# EAGLE design esp32_ics (EAGLE 9.6.2)
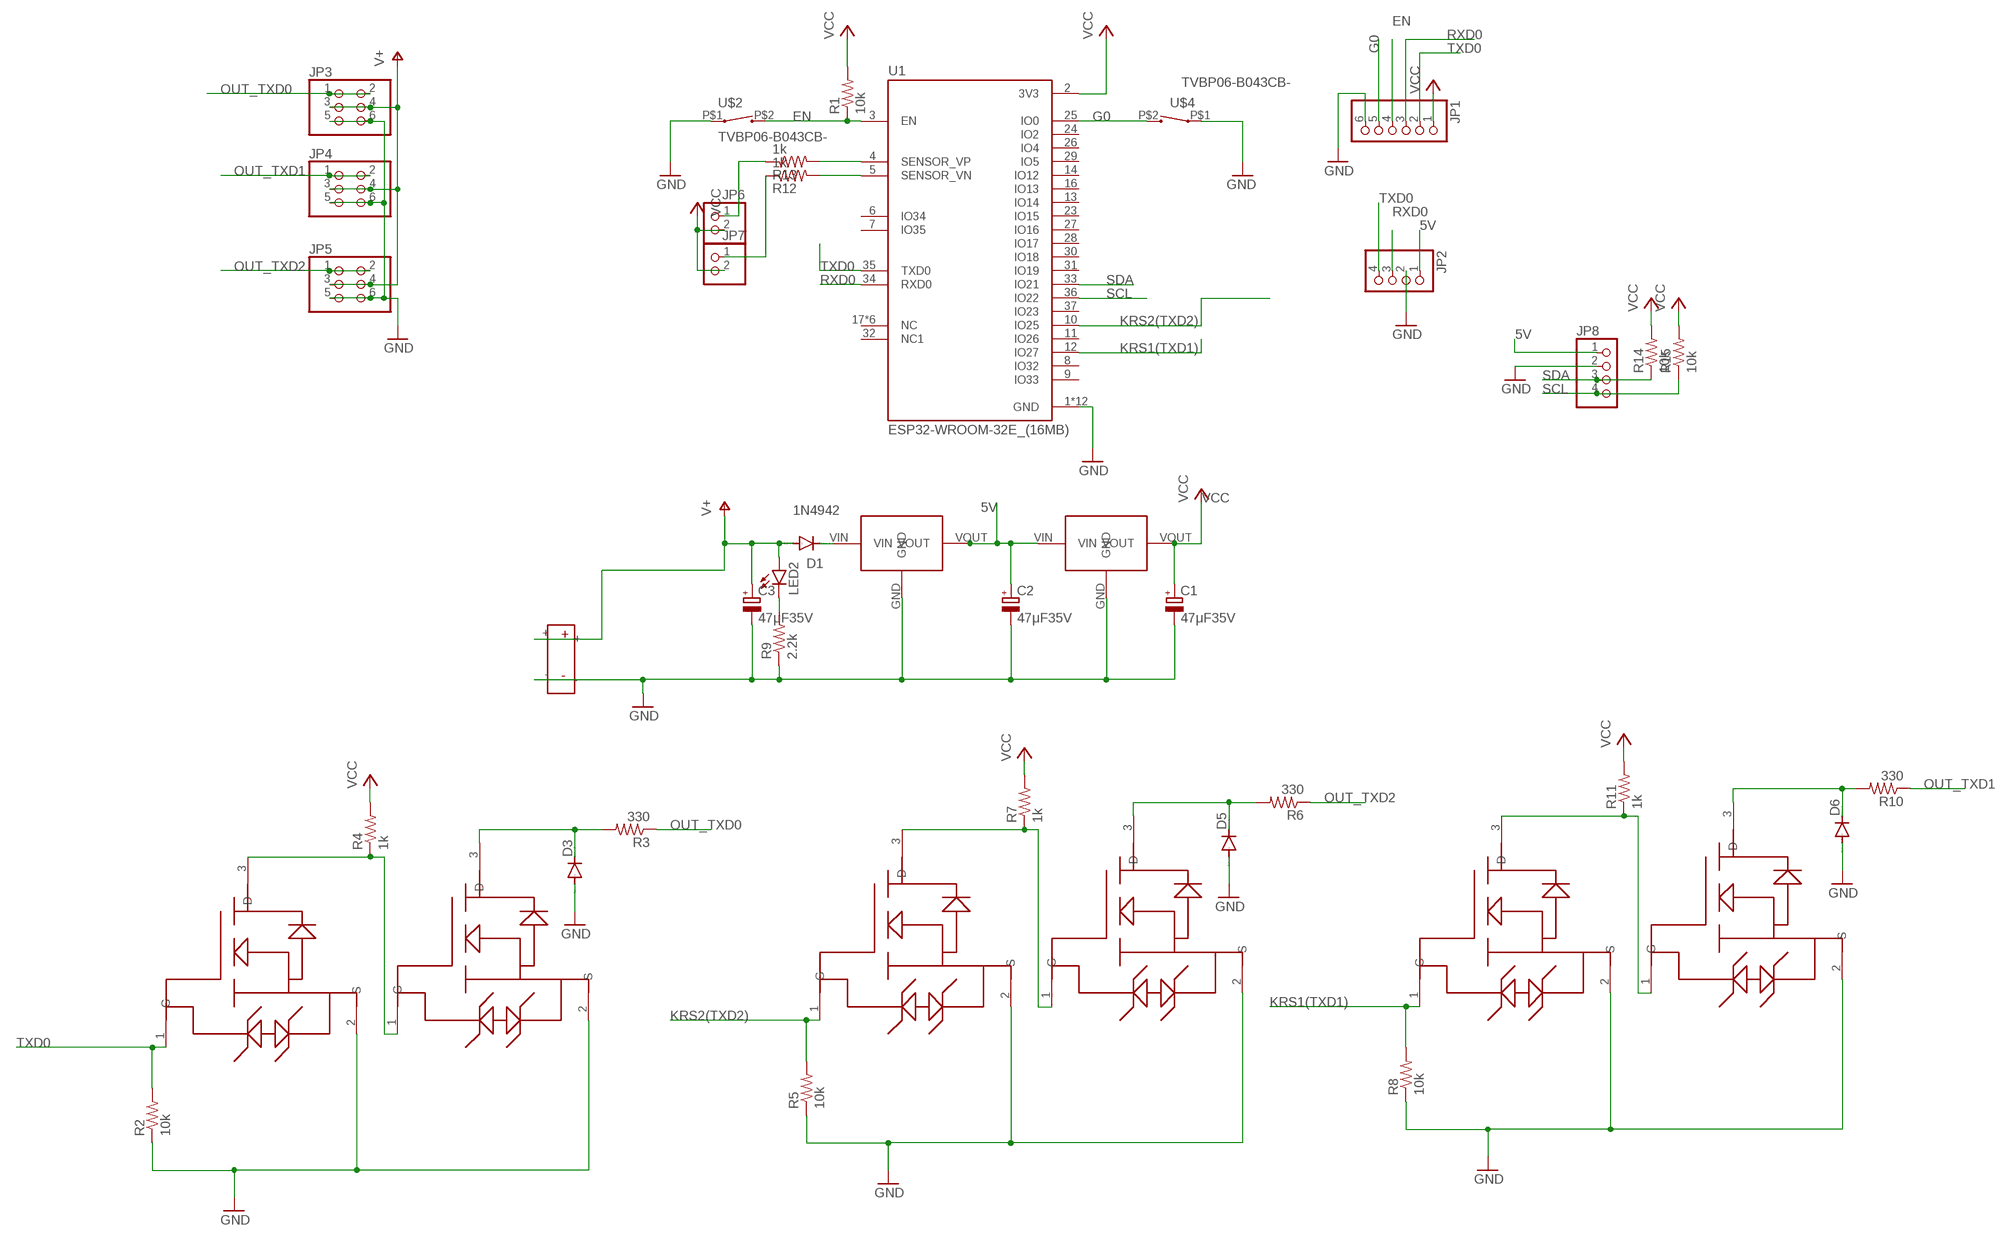
[diagram p0: schematic, sheet 1]

## Parts
C1  47μF35V  CPOL-EUE2-4  [E2-4]
C2  47μF35V  CPOL-EUE2-4  [E2-4]
C3  47μF35V  CPOL-EUE2-4  [E2-4]
D1  1N4942  [DO41-10]
D3  DIODE-SOD323-R  [SOD323-R]
D5  DIODE-SOD323-R  [SOD323-R]
D6  DIODE-SOD323-R  [SOD323-R]
JP1  PINHD-1X6  [1X06]
JP2  PINHD-1X4  [1X04]
JP3  PINHD-2X3/90  [2X03/90]
JP4  PINHD-2X3/90  [2X03/90]
JP5  PINHD-2X3/90  [2X03/90]
JP6  PINHD-1X2  [1X02]
JP7  PINHD-1X2  [1X02]
JP8  PINHD-1X4  [1X04]
LED2  LEDCHIP-LED0603  [CHIP-LED0603]
R1  10k  R-US_R0603  [R0603]
R2  10k  R-US_R0603  [R0603]
R3  330  R-US_R0603  [R0603]
R4  1k  R-US_R0603  [R0603]
R5  10k  R-US_R0603  [R0603]
R6  330  R-US_R0603  [R0603]
R7  1k  R-US_R0603  [R0603]
R8  10k  R-US_R0603  [R0603]
R9  2.2k  R-US_R0603  [R0603]
R10  330  R-US_R0603  [R0603]
R11  1k  R-US_R0603  [R0603]
R12  1k  R-US_R0603  [R0603]
R13  1k  R-US_R0603  [R0603]
R14  10k  R-US_R0603  [R0603]
R15  10k  R-US_R0603  [R0603]
U1  ESP32-WROOM-32E_(16MB)  [XCVR_ESP32-WROOM-32E_(16MB)]
U$1  BATT  [BATT]
U$2  TVBP06-B043CB-  [TVBP06-B043CB-]
U$4  TVBP06-B043CB-  [TVBP06-B043CB-]
U$5  BSS138  [SOT23]
U$6  BSS138  [SOT23]
U$7  BSS138  [SOT23]
U$8  BSS138  [SOT23]
U$9  BSS138  [SOT23]
U$10  BSS138  [SOT23]
ＮＪＭ２８４５ＤＬ１  3.3v  TIP_3TANSI  [TIP_3TANSI]
ＮＪＭ７８０５ＳＤＬ１  5v  TIP_3TANSI  [TIP_3TANSI]

## Nets
5V: C2.+ JP2.1 JP8.1 ＮＪＭ２８４５ＤＬ１.VIN ＮＪＭ７８０５ＳＤＬ１.VOUT
EN: JP1.4 R1.1 U1.3(EN) U$2.P$2
G0: JP1.5 U1.25(IO0) U$4.P$2
GND: C1.- C2.- C3.- D3.A D5.A D6.A JP1.6 JP2.2 JP3.5 JP3.6 JP4.5 JP4.6 JP5.5 JP5.6 JP8.2 R2.1 R5.1 R8.1 R9.1 U1.1(GND) U1.15(GND) U1.38(GND) U1.39_1(GND) U1.39_2(GND) U1.39_3(GND) U1.39_4(GND) U1.39_5(GND) U1.39_6(GND) U1.39_7(GND) U1.39_8(GND) U1.39_9(GND) U$1.- U$2.P$1 U$4.P$1 U$5.2(S) U$6.2(S) U$7.2(S) U$8.2(S) U$9.2(S) U$10.2(S) ＮＪＭ２８４５ＤＬ１.GND ＮＪＭ７８０５ＳＤＬ１.GND
KRS1(TXD1): R8.2 U1.12(IO27) U$9.1(G)
KRS2(TXD2): R5.2 U1.10(IO25) U$5.1(G)
N$1: R13.2 U1.4(SENSOR_VP)
N$2: R12.2 U1.5(SENSOR_VN)
N$3: LED2.C R9.2
N$4: R4.1 U$7.3(D) U$8.1(G)
N$5: JP6.1 R13.1
N$6: R7.1 U$5.3(D) U$6.1(G)
N$7: JP7.1 R12.1
N$8: R11.1 U$9.3(D) U$10.1(G)
N$10: D1.C ＮＪＭ７８０５ＳＤＬ１.VIN
OUT_TXD0: JP3.1 JP3.2 R3.1
OUT_TXD1: JP4.1 JP4.2 R10.1
OUT_TXD2: JP5.1 JP5.2 R6.1
RXD0: JP1.3 JP2.3 U1.34(RXD0)
SCL: JP8.4 R15.1 U1.36(IO22)
SDA: JP8.3 R14.1 U1.33(IO21)
TXD0: JP1.2 JP2.4 R2.2 U1.35(TXD0) U$7.1(G)
TXD1: D3.C R3.2 U$8.3(D)
TXD2: D5.C R6.2 U$6.3(D)
TXD3: D6.C R10.2 U$10.3(D)
V+: C3.+ D1.A JP3.3 JP3.4 JP4.3 JP4.4 JP5.3 JP5.4 LED2.A U$1.+
VCC: C1.+ JP1.1 JP6.2 JP7.2 R1.2 R4.2 R7.2 R11.2 R14.2 R15.2 U1.2(3V3) ＮＪＭ２８４５ＤＬ１.VOUT
Unconnected: U1.6(IO34) U1.7(IO35) U1.8(IO32) U1.9(IO33) U1.11(IO26) U1.13(IO14) U1.14(IO12) U1.16(IO13) U1.17(NC) U1.18(NC) U1.19(NC) U1.20(NC) U1.21(NC) U1.22(NC) U1.23(IO15) U1.24(IO2) U1.26(IO4) U1.27(IO16) U1.28(IO17) U1.29(IO5) U1.30(IO18) U1.31(IO19) U1.32(NC1) U1.37(IO23)

## Library data of the parts
C1-C3 = rcl:CPOL-EU: POLARIZED CAPACITOR, European symbol; SPICEPREFIX: C
D1 = diode:1N4942: DIODE 1.0 A, 200 V, 150 ns
D3 D5 D6 = diode:DIODE-: DIODE
JP1 = pinhead:PINHD-1X6: PIN HEADER
JP2 JP8 = pinhead:PINHD-1X4: PIN HEADER
JP3-JP5 = pinhead:PINHD-2X3: PIN HEADER
JP6 JP7 = pinhead:PINHD-1X2: PIN HEADER
LED2 = led:LED: LED OSRAM: - CHIPLED LG R971, LG N971, LY N971, LG Q971, LY Q971, LO R971, LY R971 LH N974, LH R974 LS Q976, LO Q976, LY Q976 LO Q996 - Hyper CHIPLED LW Q18S LB Q993, LB Q99A, LB R99A - SideLED LS A670, LO A670, LY A670, LG A670, LP A670 LB A673, LV A673, LT A673, LW A673 LH A674 LY A675 LS A676, LA A676, LO A676, LY A676, LW A676 LS A679, LY A679, LG A679 - Hyper Micro SIDELED® LS Y876, LA Y876, LO Y876, LY Y876 LT Y87S - SmartLED LW L88C, LW L88S LB L89C, LB L89S, LG L890 LS L89K, LO L89K, LY L89K LS L896, LA L896, LO L896, LY L896 - TOPLED LS T670, LO T670, LY T670, LG T670, LP T670 LSG T670, LSP T670, LSY T670, LOP T670, LYG T670 LG T671, LOG T671, LSG T671 LB T673, LV T673, LT T673, LW T673 LH T674 LS T676, LA T676, LO T676, LY T676, LB T676, LH T676, LSB T676, LW T676 LB T67C, LV T67C, LT T67C, LS T67K, LO T67K, LY T67K, LW E67C LS E67B, LA E67B, LO E67B, LY E67B, LB E67C, LV E67C, LT E67C LW T67C LS T679, LY T679, LG T679 LS T770, LO T770, LY T770, LG T770, LP T770 LB T773, LV T773, LT T773, LW T773 LH T774 LS E675, LA E675, LY E675, LS T675 LS T776, LA T776, LO T776, LY T776, LB T776 LHGB T686 LT T68C, LB T68C - Hyper Mini TOPLED® LB M676 - Mini TOPLED Santana® LG M470 LS M47K, LO M47K, LY M47K Source: http://www.osram.convergy.de LUXEON: - LUMILED® LXK2-PW12-R00, LXK2-PW12-S00, LXK2-PW14-U00, LXK2-PW14-V00 LXK2-PM12-R00, LXK2-PM12-S00, LXK2-PM14-U00 LXK2-PE12-Q00, LXK2-PE12-R00, LXK2-PE12-S00, LXK2-PE14-T00, LXK2-PE14-U00 LXK2-PB12-K00, LXK2-PB12-L00, LXK2-PB12-M00, LXK2-PB14-N00, LXK2-PB14-P00, LXK2-PB14-Q00 LXK2-PR12-L00, LXK2-PR12-M00, LXK2-PR14-Q00, LXK2-PR14-R00 LXK2-PD12-Q00, LXK2-PD12-R00, LXK2-PD12-S00 LXK2-PH12-R00, LXK2-PH12-S00 LXK2-PL12-P00, LXK2-PL12-Q00, LXK2-PL12-R00 Source: www.luxeon.com KINGBRIGHT: KA-3528ASYC Source: www.kingbright.com
R1-R15 = rcl:R-US_: RESISTOR, American symbol; SPICEPREFIX: R
U1 = ESP32-WROOM-32E__16MB_:ESP32-WROOM-32E_(16MB): Check availability <https://pricing.snapeda.com/parts/ESP32-WROOM-32E%20%2816MB%29/Espressif%20Systems/view-part?ref=eda>; AVAILABILITY: In Stock; CHECK_PRICES: https://www.snapeda.com/parts/ESP32-WROOM-32E%20(16MB)/Espressif+Systems/view-part/?ref=eda; DESCRIPTION: Bluetooth, WiFi 802.11b/g/n, Bluetooth v4.2 +EDR, Class 1, 2 and 3 Transceiver Module 2.4GHz ~ 2.5GHz Integrated, Trace Surface Mount; MF: Espressif Systems; MP: ESP32-WROOM-32E (16MB); PACKAGE: SMD-44 Espressif Systems; PRICE: None; SNAPEDA_LINK: https://www.snapeda.com/parts/ESP32-WROOM-32E%20(16MB)/Espressif+Systems/view-part/?ref=snap
U$1 = switch:BATT
U$2 U$4 = MY_switch:TVBP06-B043CB-
U$5-U$10 = Micom:BSS138
ＮＪＭ２８４５ＤＬ１ ＮＪＭ７８０５ＳＤＬ１ = untitled:TIP_3TANSI

## Board
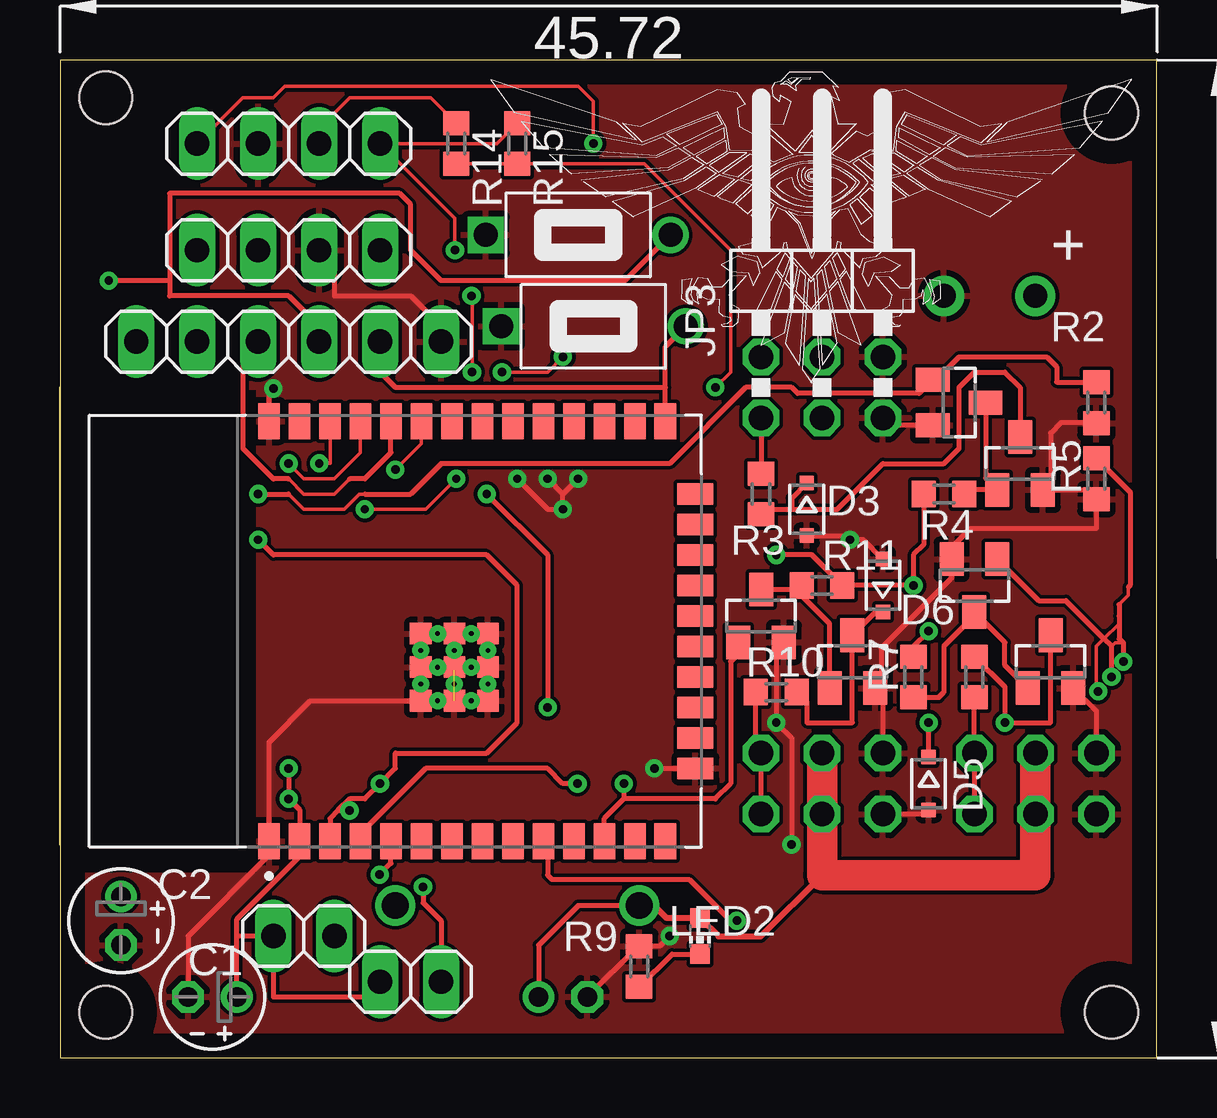
[diagram p1: board, top side]
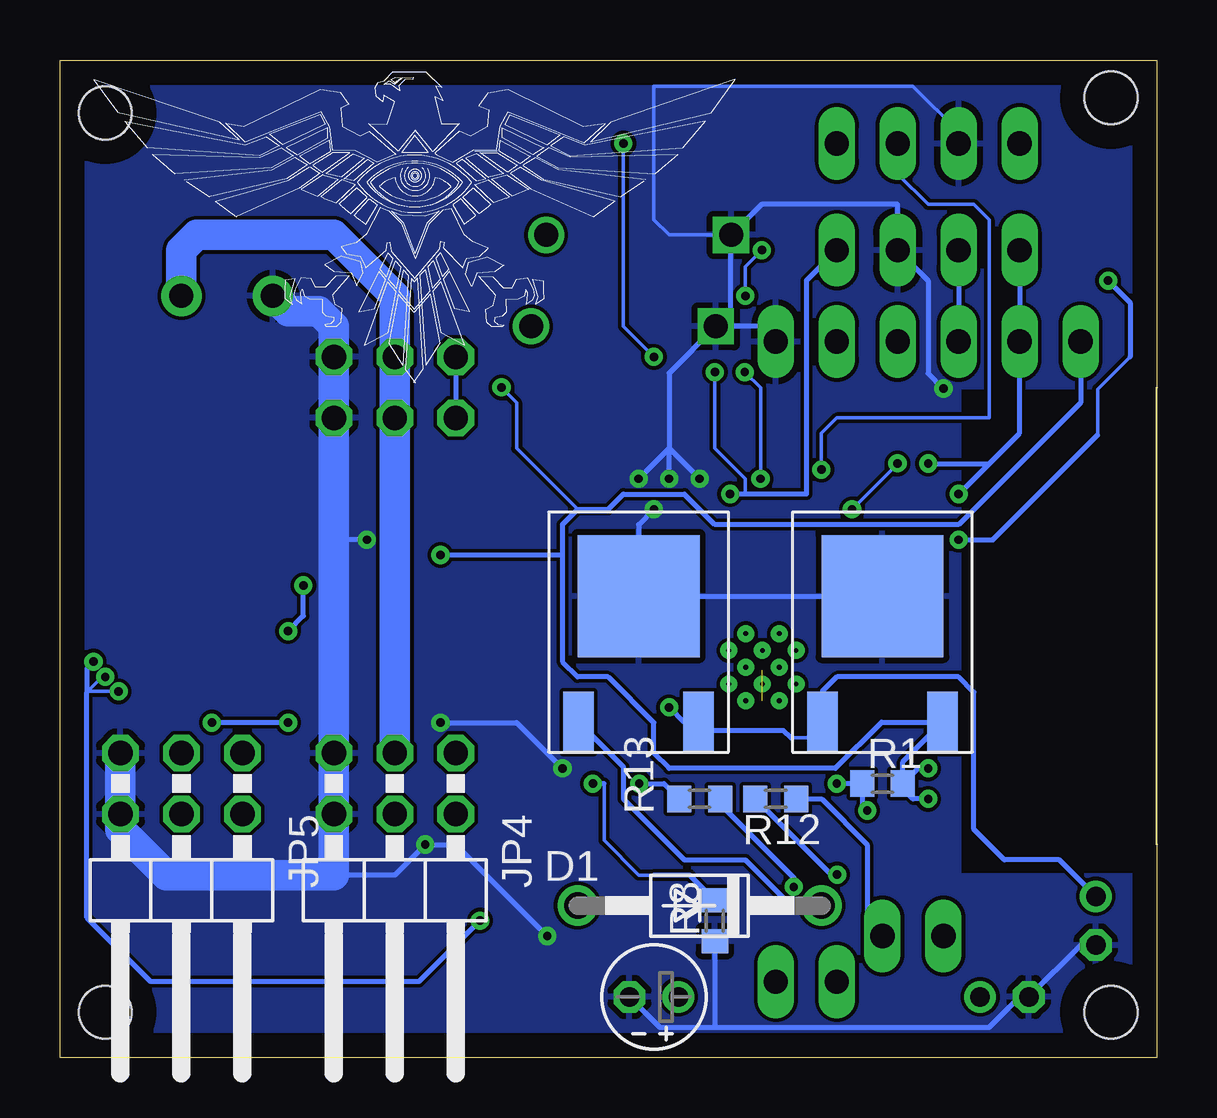
[diagram p2: board, bottom side, seen from below]

Size 45.7 x 41.58 mm. Coordinates in mm from the lower left corner, seen from the top.
Outline: 0,0 45.7,0 45.7,41.58 0,41.58 0,27.94 0,8.89 0,0
Copper layers (1*16): Top 0.035mm / dielectric 1.5mm / Bottom 0.035mm
Design rules "default": minimum track width 6mil, minimum drill 0.35mm, track to track 6mil, track to pad 6mil, pad to pad 6mil, via to via 6mil, smd to smd 6mil, copper to edge 40mil, drill to drill 6mil, minimum pad ring 10mil, minimum via ring 8mil, stop-mask expansion 4mil, vias tented up to drill 0mil, thermal gap 10mil
Holes 2.2 mm at 43.81,39.37 1.91,40.01 1.91,1.91 43.81,1.91

### Footprints (pad centres in the part's own frame; a part is rotated, then mirrored left to right if it is on the bottom)
E2-4 = drill 0.813 pad 1.27: + -1.016,0 | drill 0.813 pad 1.27 octagon: - 1.016,0
DO41-10 = drill 1.118: A 5.08,0; C -5.08,0
SOD323-R = smd 0.6 x 0.6: A 1.1,0; C -1.1,0
1X06 = drill 1.016 long: 1 -6.35,0; 2 -3.81,0; 3 -1.27,0; 4 1.27,0; 5 3.81,0; 6 6.35,0
1X04 = drill 1.016 long: 1 -3.81,0; 2 -1.27,0; 3 1.27,0; 4 3.81,0
2X03/90 = drill 1.016 octagon: 1 -2.54,-6.35; 2 -2.54,-3.81; 3 0,-6.35; 4 0,-3.81; 5 2.54,-6.35; 6 2.54,-3.81
1X02 = drill 1.016 long: 1 -1.27,0; 2 1.27,0
CHIP-LED0603 = smd 0.8 x 0.8: A 0,-0.75; C 0,0.75
R0603 = smd 1 x 1.1: 1 -0.85,0; 2 0.85,0
XCVR_ESP32-WROOM-32E_(16MB) = smd 1.5 x 0.9: 1 -8.75,5.26; 2 -8.75,3.99; 3 -8.75,2.72; 4 -8.75,1.45; 5 -8.75,0.18; 6 -8.75,-1.09; 7 -8.75,-2.36; 8 -8.75,-3.63; 9 -8.75,-4.9; 10 -8.75,-6.17; 11 -8.75,-7.44; 12 -8.75,-8.71; 13 -8.75,-9.98; 14 -8.75,-11.25; 25 8.75,-11.25; 26 8.75,-9.98; 27 8.75,-8.71; 28 8.75,-7.44; 29 8.75,-6.17; 30 8.75,-4.9; 31 8.75,-3.63; 32 8.75,-2.36; 33 8.75,-1.09; 34 8.75,0.18; 35 8.75,1.45; 36 8.75,2.72; 37 8.75,3.99; 38 8.75,5.26 | smd 0.9 x 1.5: 15 -5.715,-12.5; 16 -4.445,-12.5; 17 -3.175,-12.5; 18 -1.905,-12.5; 19 -0.635,-12.5; 20 0.635,-12.5; 21 1.905,-12.5; 22 3.175,-12.5; 23 4.445,-12.5; 24 5.715,-12.5 | smd 0.9 x 0.9: 39_1 -2.9,-1.06; 39_2 -1.5,-1.06; 39_3 -0.1,-1.06; 39_4 -2.9,-2.46; 39_5 -1.5,-2.46; 39_6 -0.1,-2.46; 39_7 -2.9,-3.86; 39_8 -1.5,-3.86; 39_9 -0.1,-3.86 | drill 0.2 pad 0.3: 39_10 -2.2,-1.06; 39_11 -0.8,-1.06; 39_12 -2.9,-1.76; 39_13 -1.5,-1.76; 39_14 -0.1,-1.76; 39_15 -2.2,-2.46; 39_16 -0.8,-2.46; 39_17 -2.9,-3.16; 39_18 -1.5,-3.16; 39_19 -0.1,-3.16; 39_20 -2.2,-3.86; 39_21 -0.8,-3.86
BATT = drill 1 pad 1.676: + 0,2.54; - 0,-1.27
TVBP06-B043CB- = drill 1 square: P$1 -3.85,0 | drill 1: P$2 3.85,0
SOT23 = smd 1 x 1.4: 1 -0.95,-1.1; 2 0.95,-1.1; 3 0,1.1
TIP_3TANSI = smd 5.08 x 5.08: GND 0,4 | smd 1.27 x 2.54: VIN -2.5,-1.25; VOUT 2.5,-1.25

### Placement (x,y rotation side)
C1  6.35,2.54 180 top
C2  2.54,5.71 270 top
C3  20.95,2.54 180 bottom
D1  19.05,6.35 180 bottom
D3  31.11,22.86 270 top
D5  36.2,11.43 270 top
D6  34.29,19.69 90 top
JP1  9.53,29.84 0 top
JP2  9.53,33.66 180 top
JP3  31.75,33.02 0 top
JP4  31.75,6.35 180 bottom
JP5  40.64,6.35 180 bottom
JP6  14.61,3.18 180 top
JP7  10.16,5.08 180 top
JP8  9.53,38.1 0 top
LED2  26.67,5.08 180 top
R1  11.43,11.43 0 bottom
R2  43.18,27.3 90 top
R3  29.21,23.49 270 top
R4  36.83,23.49 180 top
R5  43.18,24.13 90 top
R6  38.1,15.87 90 top
R7  35.56,15.87 90 top
R8  18.41,5.71 90 bottom
R9  24.13,3.81 270 top
R10  29.84,15.24 0 top
R11  31.75,19.69 0 top
R12  15.88,10.79 180 bottom
R13  19.05,10.79 180 bottom
R14  16.51,38.1 270 top
R15  19.05,38.1 270 top
U1  13.97,17.78 90 top
U$1  38.1,31.75 270 top
U$2  21.59,34.29 0 top
U$4  22.23,30.48 0 top
U$5  38.1,19.69 180 top
U$6  41.27,16.51 0 top
U$7  37.47,27.3 270 top
U$8  40.01,24.77 0 top
U$9  29.21,18.41 0 top
U$10  33.02,16.51 0 top
U$14  [SHOKER]  30.93,34.62 0 bottom
U$15  [SHOKER]  31.3,34.62 0 top
ＮＪＭ２８４５ＤＬ１  11.43,15.24 0 bottom
ＮＪＭ７８０５ＳＤＬ１  21.59,15.24 0 bottom

### Tracks (layer width: path | path; a pad name or v marks a point on that pad's centre or on a via)
5V  (via drill 0.35)
  Top 0.152: JP8.1 7.62,40.01 8.89,40.01 9.37,40.49 21.59,40.49 22.23,39.85 v22.23,38.1 | v20.95,29.21 20.32,28.58 v18.41,28.58
  Top 0.2: v17.78,23.49 20.32,20.95 v20.32,14.6
  Bottom 0.152: 15.24,13.33 14.59,13.33 ＮＪＭ２８４５ＤＬ１.VIN | v22.23,38.1 22.23,30.48 v20.95,29.21 | v18.41,28.58 18.41,25.4 17.14,24.13 17.14,23.49
  Bottom 0.2: 15.24,13.33 15.56,13.65 18.75,13.65 ＮＪＭ７８０５ＳＤＬ１.VOUT 19.7,13.99 v20.32,14.6 | ＮＪＭ２８４５ＤＬ１.VIN 13.93,15.28 13.34,15.87 8.26,15.87 7.62,15.24 7.62,9.53 6.35,8.26 4.06,8.26 C2.+ | JP2.1 14.61,32.39 14.61,23.49 17.14,23.49 v17.78,23.49
EN  (via drill 0.35)
  Top 0.2: 11.58,10.31 12.06,10.79 12.7,10.79 v13.34,11.43 13.97,12.06 13.97,12.7 17.78,12.7 19.05,13.97 19.05,19.69 17.78,20.95 8.89,20.95 v8.26,21.59 | 11.58,10.31 11.25,9.98 U1.3 | 4.57,32.39 v2.03,32.39 | JP1.4 10.79,30.48 9.53,31.75 4.57,31.75 4.57,32.39 | U$2.P$2 23.54,32.39 15.88,32.39 14.61,33.66 14.61,35.56 14.15,36.02 4.57,36.02 4.57,32.39 | 11.58,10.31 v12.06,10.31
  Bottom 0.152: 1.12,29.21 2.46,27.86 2.46,25.96
  Bottom 0.2: v13.34,11.43 R1.1 12.28,10.53 v12.06,10.31 | v8.26,21.59 6.83,21.59 2.46,25.96 | 1.12,29.21 1.12,31.47 v2.03,32.39
G0
  Top 0.2: U1.25 25.22,27.94 | 25.22,27.94 25.22,29.62 U$4.P$2 | JP1.5 13.34,28.58 13.97,27.94 25.22,27.94
GND  (via drill 0.35)  (1 unrouted)
  Top 0.152: U1.39_5 16.43,16.16
  Top 0.2: C3.- 24.09,4.66 R9.1 24.98,4.66 v25.4,5.08 | C1.- 5.33,5.08 8.71,8.46 U1.1 8.71,13.15 10.44,14.88 U1.39_1 | U$9.2 29.84,17 v29.84,13.97 30.48,13.33 v30.48,8.89 | U$10.2 34.22,15.17 | 34.22,15.17 34.29,15.09 JP4.5 | U1.38 8.71,27.71 v8.89,27.89 | JP2.2 11.43,33.02 11.43,31.75 14.61,31.75 15.88,30.48 JP1.6 | v20.32,24.13 20.95,23.49 | 20.95,23.49 v20.95,22.86 20.32,22.86 v19.05,24.13 | v24.77,12.06 U1.15 | U$6.2 43.18,14.46 JP5.5 | 34.22,15.17 34.22,17.07 37.15,20.01 U$5.2 37.15,21.27 37.93,22.05 43.18,22.05 R5.1 42.8,23.66 41.27,23.66 | U$8.2 41.27,23.66 | U$7.2 34.6,26.35 JP3.5 | 41.27,23.66 41.27,26.03 41.7,26.45 R2.1 | D3.A 32.75,21.76 v32.92,21.59 33.48,21.59 D6.A | D5.A 36.02,10.16 JP4.6 | 20.95,23.49 v21.59,24.13
  Bottom 0.152: JP8.2 8.26,38.58 10.16,40.49 20.95,40.49 20.95,34.93 20.32,34.29 U$2.P$1
  Bottom 0.2: C3.- 20.7,1.27 18.41,1.27 | 18.41,1.27 6.99,1.27 5.71,2.54 C1.- 3.17,4.7 C2.- | ＮＪＭ２８４５ＤＬ１.GND ＮＪＭ７８０５ＳＤＬ１.GND 21.59,22.23 v20.95,22.86 | 34.29,7.62 31.75,7.62 v30.48,8.89 29.21,8.89 v25.4,5.08 | 17.78,30.48 17.78,34.25 U$2.P$1 16.47,35.56 10.79,35.56 JP2.2 9.53,32.39 9.53,28.52 v8.89,27.89 | 17.78,30.48 U$4.P$1 20.32,28.54 20.32,25.4 | JP1.6 16.51,30.48 17.78,30.48 | v20.32,24.13 20.32,25.4 | 24.59,12.06 v24.77,12.06 26.67,13.97 v29.84,13.97 | R8.1 18.41,1.27 | v32.92,21.59 34.29,21.59 | 20.32,25.4 v21.59,24.13 | 20.32,25.4 v19.05,24.13
  Bottom 1.27: JP5.5 JP5.6 43.18,9.53 41.27,7.62 34.29,7.62 JP4.6 JP4.5 34.29,21.59 JP3.5 JP3.6 34.29,30.48 34.92,31.12 36.2,31.12 U$1.-
  pour Bottom: 0,41.27 0,27.94 8.26,27.94 8.26,7.62 0,7.62 0,0 45.72,0 45.72,41.27
  pour Top: 0,41.27 0,27.94 8.26,27.94 8.26,7.62 0,7.62 0,0 45.72,0 45.72,41.27
KRS1(TXD1)  (via drill 0.35)
  Top 0.152: U1.12 22.68,9.53
  Top 0.2: U$9.1 28.26,16.83 27.94,16.51 27.94,11.43 27.3,10.79 23.5,10.79 | 22.68,9.53 22.68,9.98 23.5,10.79 | v23.5,11.43 23.5,10.79
  Bottom 0.152: 20.95,7.62 21.59,7.62 23.03,9.06 23.03,11.43
  Bottom 0.2: 23.03,11.43 v23.5,11.43 | R8.2 19.47,7.62 20.95,7.62
KRS2(TXD2)  (via drill 0.35)
  Top 0.152: 44.13,18.41 44.13,18.1 43.5,17.46 43.18,17.15 43.18,15.35 v43.26,15.27 | 43.81,17.15 43.96,17.29 44.31,17.29 | 44.13,18.9 44.52,19.29 44.52,19.62
  Top 0.2: U1.10 20.32,8.85 20.32,7.62 20.5,7.44 26.22,7.44 27.94,5.72 v28.2,5.72 | U$5.1 40.78,19.05 41.91,19.05 43.5,17.46 43.81,17.15 v43.81,15.87 | v44.31,16.51 44.31,17.29 44.13,17.46 44.13,18.41 44.13,18.9 | R5.2 44.58,23.58 44.58,19.69 44.52,19.62
  Bottom 0.152: v43.81,15.87 43.95,15.87 44.55,15.27 | 44.58,15.24 44.55,15.27 | 44.55,15.27 v43.26,15.27
  Bottom 0.2: v28.2,5.72 30.75,3.18 41.91,3.18 44.58,5.85 44.58,15.24 44.58,16.23 v44.31,16.51
N$1  (via drill 0.35)
  Top 0.2: v21.56,11.43 20.95,11.43 20.32,12.06 15.24,12.06 12.52,9.35 U1.4
  Bottom 0.2: R13.2 20.54,11.43 v21.56,11.43
N$2  (via drill 0.35)
  Top 0.2: v13.32,7.63 13.79,8.11 U1.5
  Bottom 0.2: R12.2 13.56,7.63 v13.32,7.63
N$3
  Top 0.2: R9.2 25.5,4.33 LED2.C
N$4
  Top 0.2: U$7.3 38.56,24.16 U$8.1 37.85,23.66 R4.1
N$5  (via drill 0.35)
  Top 0.2: v15.13,7.13 15.13,6.46 15.88,5.71 JP6.1
  Bottom 0.2: R13.1 18.2,10.58 15.13,7.51 v15.13,7.13
N$6
  Top 0.2: U$6.1 39.37,16.37 39.37,17.31 38.19,18.5 | 38.19,18.5 U$5.3 | R7.1 36.62,15.03 36.83,15.24 36.83,17.15 38.19,18.5
N$7
  Bottom 0.2: R12.1 13.97,10.79 12.06,8.89 12.06,5.71 JP7.1
N$8
  Top 0.2: U$10.1 32.07,18.09 30.65,19.52 | 30.65,19.52 U$9.3 | 30.65,19.52 30.73,19.52 R11.1
N$10
  Bottom 0.2: ＮＪＭ７８０５ＳＤＬ１.VIN 22.23,12.12 22.23,10.79 19.68,8.26 17.14,8.26 15.24,6.35 D1.C
OUT_TXD0
  Top 0.2: JP3.1 R3.1
  Bottom 0.2: JP3.2 JP3.1
OUT_TXD1
  Top 0.2: JP4.2 JP4.1 29,12.92 R10.1
OUT_TXD2
  Top 0.2: JP5.2 JP5.1 R6.1
RXD0
  Top 0.152: 12.06,24.13 11.43,23.49 10.16,23.49 9.53,24.13
  Top 0.2: JP1.3 7.62,29.21 7.62,25.4 8.89,24.13 9.53,24.13 | U1.34 13.79,25.22 12.7,24.13 12.06,24.13
  Bottom 0.2: JP2.3 JP1.3
SCL  (via drill 0.35)
  Top 0.152: v16.45,33.66 16.45,34.98 JP8.4 18.2,38.1 R15.1 | v17.14,31.75 17.17,31.73 v17.17,28.58 | v16.51,24.13 15.24,22.86 v12.7,22.86 | v10.8,24.77 11.25,24.77 U1.36
  Bottom 0.152: v16.45,33.66 17.14,32.97 v17.14,31.75 | v17.17,28.58 16.51,27.92 v16.51,24.13 | v12.7,22.86 10.8,24.76 v10.8,24.77
SDA  (via drill 0.35)
  Top 0.152: v13.97,24.51 15.06,25.6 U1.33 | R14.1 15.46,40.01 12.06,40.01 10.79,38.73 JP8.3
  Bottom 0.152: JP8.3 10.79,36.83 9.53,35.56 7.62,35.56 6.99,34.93 6.99,26.67 13.34,26.67 13.97,26.03 v13.97,24.51
TXD0  (via drill 0.35)
  Top 0.152: 9.53,23.49 10.16,22.86 11.84,22.86 12.48,23.49 12.7,23.49 | U1.35 12.52,25.22 11.43,24.13 10.16,24.13 v9.53,24.77
  Top 0.2: 12.7,23.49 14.61,23.49 15.88,24.77 25.4,24.77 28.57,27.94 30.48,27.94 30.74,27.68 35.79,27.68 U$7.1 36.51,28.26 37.47,29.21 41.1,29.21 41.52,28.79 41.52,28.16 R2.2 | v8.26,23.49 9.53,23.49
  Bottom 0.2: JP2.4 JP1.2 5.71,26.03 6.99,24.77 | v9.53,24.77 6.99,24.77 | v8.26,23.49 6.99,24.77
TXD1
  Top 0.2: R3.2 29.43,22.86 30.48,22.86 | 30.48,22.86 32.38,22.86 34.29,24.77 36.83,24.77 37.47,25.4 37.47,27.94 38.1,28.58 39.37,28.58 40.01,27.94 U$8.3 | D3.C 30.48,23.33 30.48,22.86
TXD2  (via drill 0.35)
  Top 0.2: R6.2 39.37,15.46 v39.37,13.97 41.27,13.97 U$6.3 | D5.C v36.2,13.97
  Bottom 0.2: v36.2,13.97 v39.37,13.97
TXD3
  Top 0.2: R10.2 31.11,14.82 31.11,13.97 33.02,13.97 U$10.3 33.99,18.59 D6.C
V+
  Top 0.2: 24.77,6.35 D1.A 21.59,6.35 19.94,4.7 C3.+
  Top 0.254: 31.75,7.62 29.19,5.06 27.44,5.06 LED2.A 25.29,5.83 24.77,6.35
  Top 1.27: JP4.3 JP4.4 31.75,7.62 40.64,7.62 JP5.4 JP5.3
  Bottom 1.27: JP4.3 JP3.3 JP3.4 31.75,31.75 34.29,34.29 40.01,34.29 40.64,33.66 U$1.+
VCC  (via drill 0.35)
  Top 0.152: R14.2 R15.2 24.34,37.25 27.94,33.66 27.94,28.58 v27.3,27.94
  Top 0.2: v29.84,20.95 31.33,20.95 R11.2 v35.56,19.69 35.56,20.95 35.98,21.38 R4.2 | R7.2 35.56,17.15 v36.2,17.78 | C1.+ 7.37,5.08 | 7.37,5.08 7.37,5.78 9.98,8.39 U1.2 9.98,10.34 v9.53,10.79 v9.53,12.06 | 7.37,5.08 JP7.2 8.89,2.54 12.7,2.54 JP6.2
  Bottom 0.152: v27.3,27.94 26.67,27.3 26.67,25.4 24.13,22.86
  Bottom 0.2: R1.2 10.58,12.34 ＮＪＭ２８４５ＤＬ１.VOUT 11.47,13.99 13.39,12.06 20.32,12.06 20.95,12.7 20.95,13.97 22.86,15.87 24.13,15.87 24.77,16.51 24.77,20.95 | JP1.1 3.17,27.3 8.26,22.23 18.41,22.23 19.68,23.49 22.23,23.49 22.86,22.86 24.13,22.86 24.77,22.23 24.77,20.95 | v29.84,20.95 24.77,20.95 | v36.2,17.78 35.56,18.41 v35.56,19.69 | R1.2 9.95,12.06 v9.53,12.06 | v9.53,10.79 10.16,10.79 10.58,11.22 R1.2

### Text on the board
tPlace: +